# EAGLE design 120_01_ISC_BASE_BOARD (EAGLE 9.6.2)
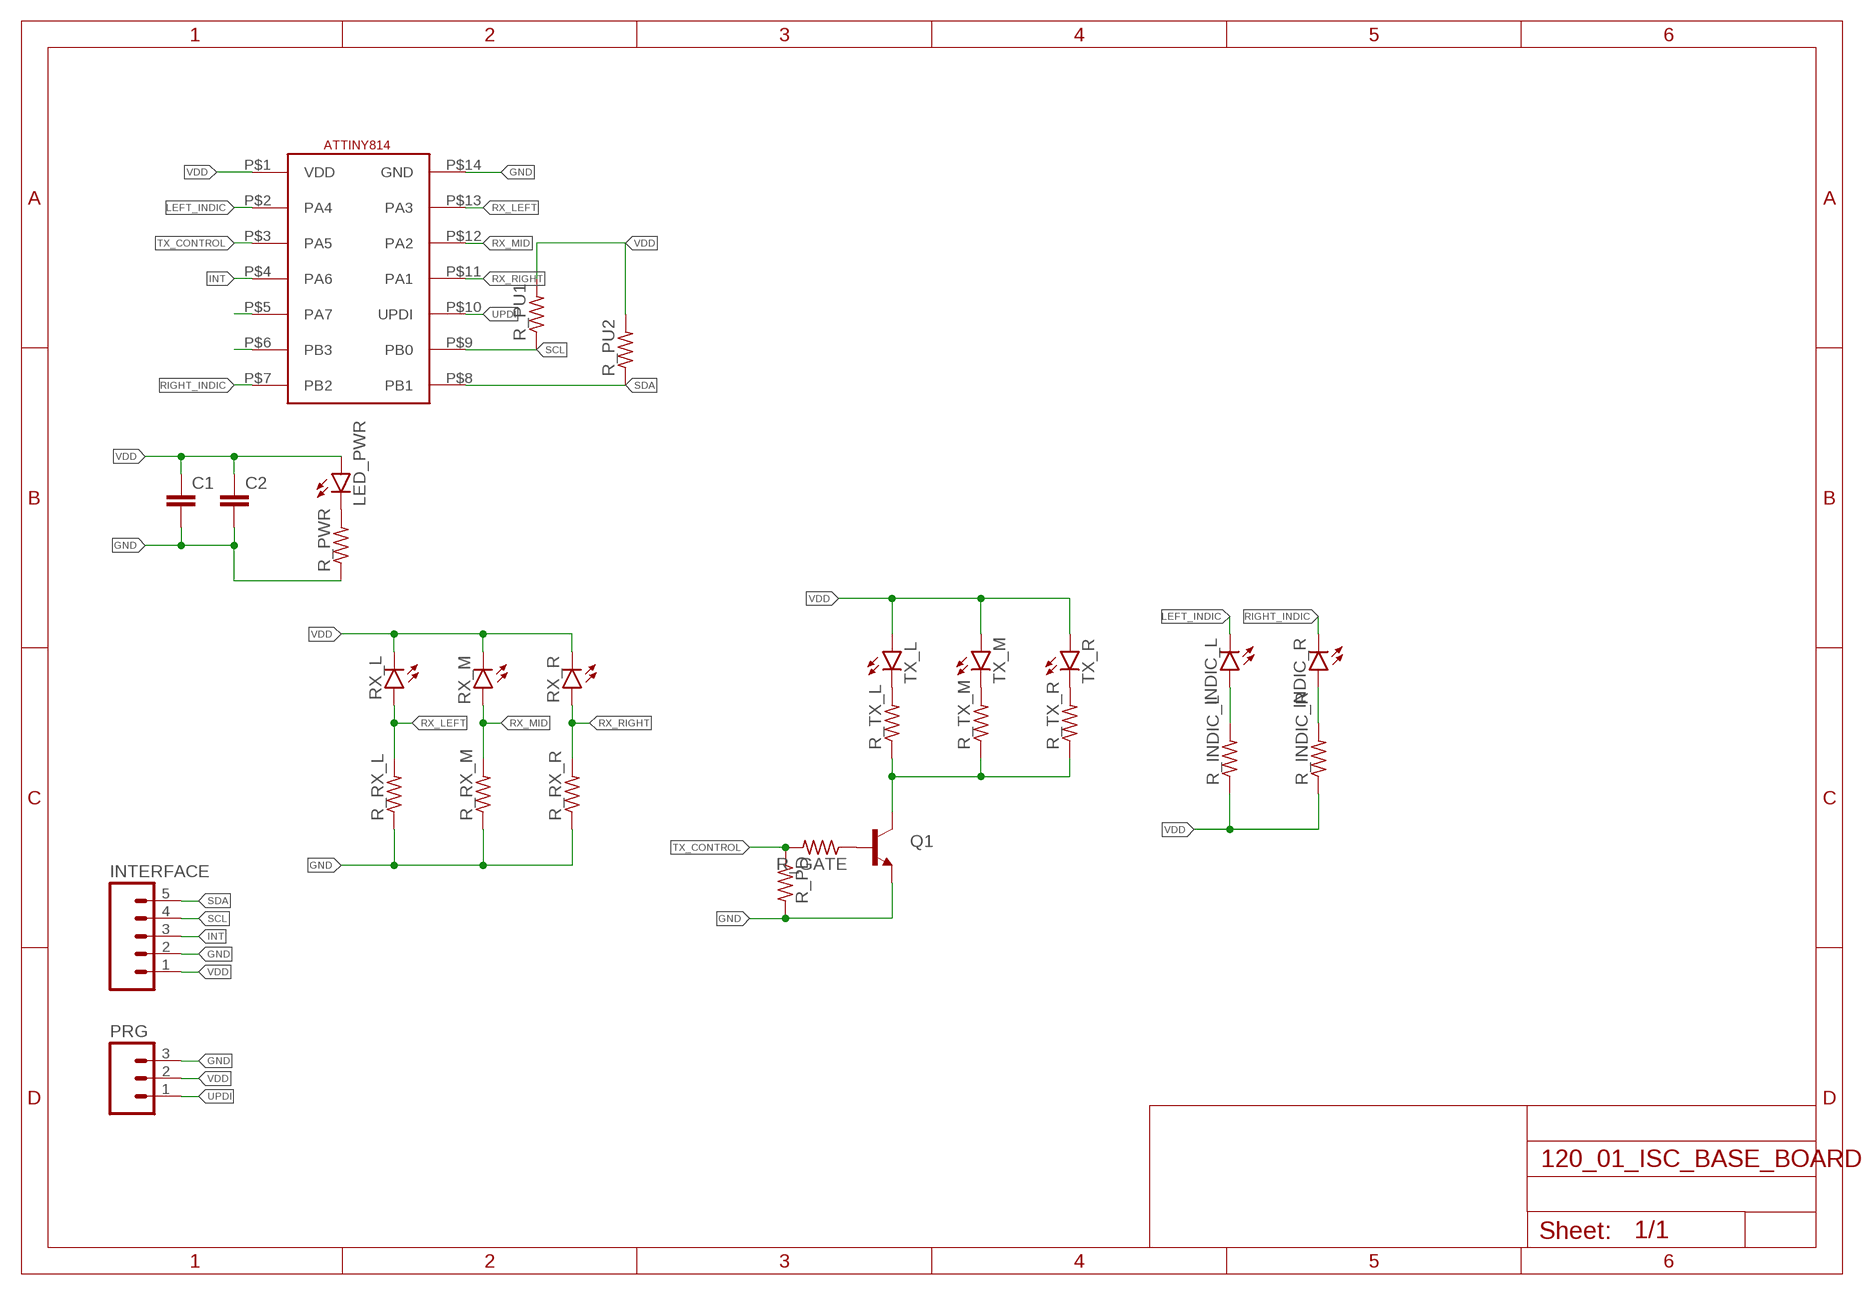
[diagram p0: schematic, sheet 1]

## Parts
C1  C-EUC0805  [C0805]
C2  C-EUC0805  [C0805]
INDIC_L  LED3MM  [LED3MM]
INDIC_R  LED3MM  [LED3MM]
INTERFACE  M05NO_SILK  [1X05_NO_SILK]
LED_PWR  LEDCHIP-LED0805  [CHIP-LED0805]
PRG  M03PTH  [1X03]
Q1  TRANSISTOR_NPNBC547  [TO-92-AMMO]
R_GATE  R-US_R0805  [R0805]
R_INDIC_L  R-US_R0805  [R0805]
R_INDIC_R  R-US_R0805  [R0805]
R_PD  R-US_R0805  [R0805]
R_PU1  R-US_R0805  [R0805]
R_PU2  R-US_R0805  [R0805]
R_PWR  R-US_R0805  [R0805]
R_RX_L  R-US_R0805  [R0805]
R_RX_M  R-US_R0805  [R0805]
R_RX_R  R-US_R0805  [R0805]
R_TX_L  R-US_R0805  [R0805]
R_TX_M  R-US_R0805  [R0805]
R_TX_R  R-US_R0805  [R0805]
RX_L  LED3MM  [LED3MM]
RX_M  LED3MM  [LED3MM]
RX_R  LED3MM  [LED3MM]
TX_L  LED5MM  [LED5MM]
TX_M  LED5MM  [LED5MM]
TX_R  LED5MM  [LED5MM]
U$1  ATTINY814  [ATTINY814]

## Nets
GND: C1.2 C2.2 INTERFACE.2 PRG.3 Q1.3(E) R_PD.2 R_PWR.1 R_RX_L.1 R_RX_M.1 R_RX_R.1 U$1.P$14(GND)
INT: INTERFACE.3 U$1.P$4(PA6)
LEFT_INDIC: INDIC_L.K(C) U$1.P$2(PA4)
N$1: LED_PWR.C R_PWR.2
N$2: INDIC_L.A R_INDIC_L.2
N$3: INDIC_R.A R_INDIC_R.2
N$5: R_TX_L.2 TX_L.K(C)
N$6: R_TX_M.2 TX_M.K(C)
N$7: R_TX_R.2 TX_R.K(C)
N$9: Q1.1(C) R_TX_L.1 R_TX_M.1 R_TX_R.1
N$10: Q1.2(B) R_GATE.1
N$12: U$1.P$6(PB3)
N$14: U$1.P$5(PA7)
RIGHT_INDIC: INDIC_R.K(C) U$1.P$7(PB2)
RX_LEFT: R_RX_L.2 RX_L.A U$1.P$13(PA3)
RX_MID: R_RX_M.2 RX_M.A U$1.P$12(PA2)
RX_RIGHT: R_RX_R.2 RX_R.A U$1.P$11(PA1)
SCL: INTERFACE.4 R_PU1.1 U$1.P$9(PB0)
SDA: INTERFACE.5 R_PU2.1 U$1.P$8(PB1)
TX_CONTROL: R_GATE.2 R_PD.1 U$1.P$3(PA5)
UPDI: PRG.1 U$1.P$10(UPDI)
VDD: C1.1 C2.1 INTERFACE.1 LED_PWR.A PRG.2 R_INDIC_L.1 R_INDIC_R.1 R_PU1.2 R_PU2.2 RX_L.K(C) RX_M.K(C) RX_R.K(C) TX_L.A TX_M.A TX_R.A U$1.P$1(VDD)

## Library data of the parts
C1 C2 = rcl:C-EU: CAPACITOR, European symbol; SPICEPREFIX: C
INDIC_L INDIC_R LED_PWR RX_L RX_M RX_R TX_L TX_M TX_R = led:LED: LED OSRAM: - CHIPLED LG R971, LG N971, LY N971, LG Q971, LY Q971, LO R971, LY R971 LH N974, LH R974 LS Q976, LO Q976, LY Q976 LO Q996 - Hyper CHIPLED LW Q18S LB Q993, LB Q99A, LB R99A - SideLED LS A670, LO A670, LY A670, LG A670, LP A670 LB A673, LV A673, LT A673, LW A673 LH A674 LY A675 LS A676, LA A676, LO A676, LY A676, LW A676 LS A679, LY A679, LG A679 - Hyper Micro SIDELED® LS Y876, LA Y876, LO Y876, LY Y876 LT Y87S - SmartLED LW L88C, LW L88S LB L89C, LB L89S, LG L890 LS L89K, LO L89K, LY L89K LS L896, LA L896, LO L896, LY L896 - TOPLED LS T670, LO T670, LY T670, LG T670, LP T670 LSG T670, LSP T670, LSY T670, LOP T670, LYG T670 LG T671, LOG T671, LSG T671 LB T673, LV T673, LT T673, LW T673 LH T674 LS T676, LA T676, LO T676, LY T676, LB T676, LH T676, LSB T676, LW T676 LB T67C, LV T67C, LT T67C, LS T67K, LO T67K, LY T67K, LW E67C LS E67B, LA E67B, LO E67B, LY E67B, LB E67C, LV E67C, LT E67C LW T67C LS T679, LY T679, LG T679 LS T770, LO T770, LY T770, LG T770, LP T770 LB T773, LV T773, LT T773, LW T773 LH T774 LS E675, LA E675, LY E675, LS T675 LS T776, LA T776, LO T776, LY T776, LB T776 LHGB T686 LT T68C, LB T68C - Hyper Mini TOPLED® LB M676 - Mini TOPLED Santana® LG M470 LS M47K, LO M47K, LY M47K Source: http://www.osram.convergy.de LUXEON: - LUMILED® LXK2-PW12-R00, LXK2-PW12-S00, LXK2-PW14-U00, LXK2-PW14-V00 LXK2-PM12-R00, LXK2-PM12-S00, LXK2-PM14-U00 LXK2-PE12-Q00, LXK2-PE12-R00, LXK2-PE12-S00, LXK2-PE14-T00, LXK2-PE14-U00 LXK2-PB12-K00, LXK2-PB12-L00, LXK2-PB12-M00, LXK2-PB14-N00, LXK2-PB14-P00, LXK2-PB14-Q00 LXK2-PR12-L00, LXK2-PR12-M00, LXK2-PR14-Q00, LXK2-PR14-R00 LXK2-PD12-Q00, LXK2-PD12-R00, LXK2-PD12-S00 LXK2-PH12-R00, LXK2-PH12-S00 LXK2-PL12-P00, LXK2-PL12-Q00, LXK2-PL12-R00 Source: www.luxeon.com KINGBRIGHT: KA-3528ASYC Source: www.kingbright.com
INTERFACE = SparkFun-Connectors:M05: Header 5 Standard 5-pin 0.1" header. Use with straight break away headers (SKU : PRT-00116), right angle break away headers (PRT-00553), swiss pins (PRT-00743), machine pins (PRT-00117), and female headers (PRT-00115). Molex polarized connector foot print use with SKU : PRT-08230 with associated crimp pins and housings.
PRG = SparkFun-Connectors:M03: Header 3 Standard 3-pin 0.1" header. Use with straight break away headers (SKU : PRT-00116), right angle break away headers (PRT-00553), swiss pins (PRT-00743), machine pins (PRT-00117), and female headers (PRT-00115). Molex polarized connector foot print use with SKU : PRT-08232 with associated crimp pins and housings.
Q1 = SparkFun-DiscreteSemi:TRANSISTOR_NPN: Generic NPN BJT MMBT2222A - TRANS-08049 (SOT-23, 1A 40V) MPSA42 - TRANS-09116 (SOT-23, 500mA 300V) MMBT5088LT1G - TRANS-11160 (SOT-23, 50 mA 30V) BC547 - COM-08928 <http://www.sparkfun.com/products/8928> (TO-92 45V 100mA) (1.Collector 2.Base 3.Emitter) 2N3904 - COM-00521 <http://www.sparkfun.com/products/521> (TO-92 40V 200mA) (1.Emitter 2.Base 3.Collector) P2N2222A - COM-12852 <http://www.sparkfun.com/products/12852> (TO-92 40V 600mA) (1.Collector 2.Base 3.Emitter)
R_GATE R_INDIC_L R_INDIC_R R_PD R_PU1 R_PU2 R_PWR R_RX_L R_RX_M R_RX_R R_TX_L R_TX_M R_TX_R = rcl:R-US_: RESISTOR, American symbol; SPICEPREFIX: R
U$1 = Stephen:ATTINY814

## Board
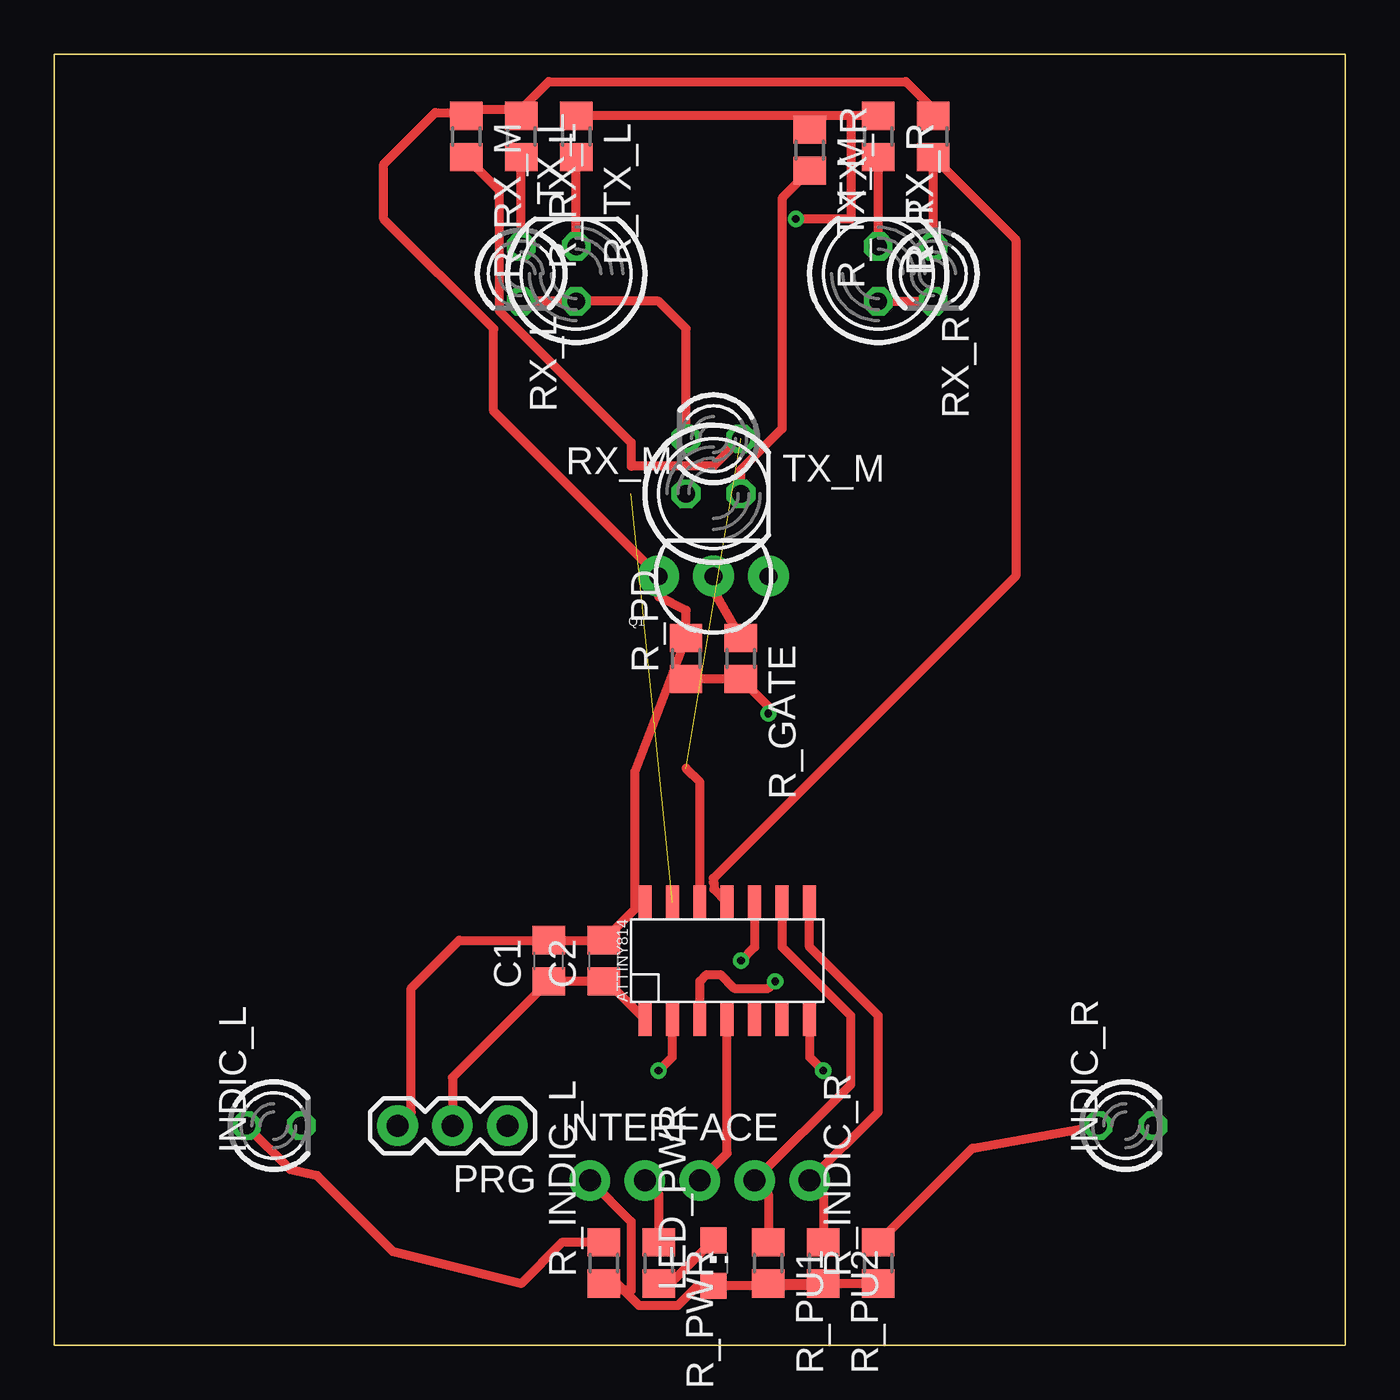
[diagram p1: board, top side]
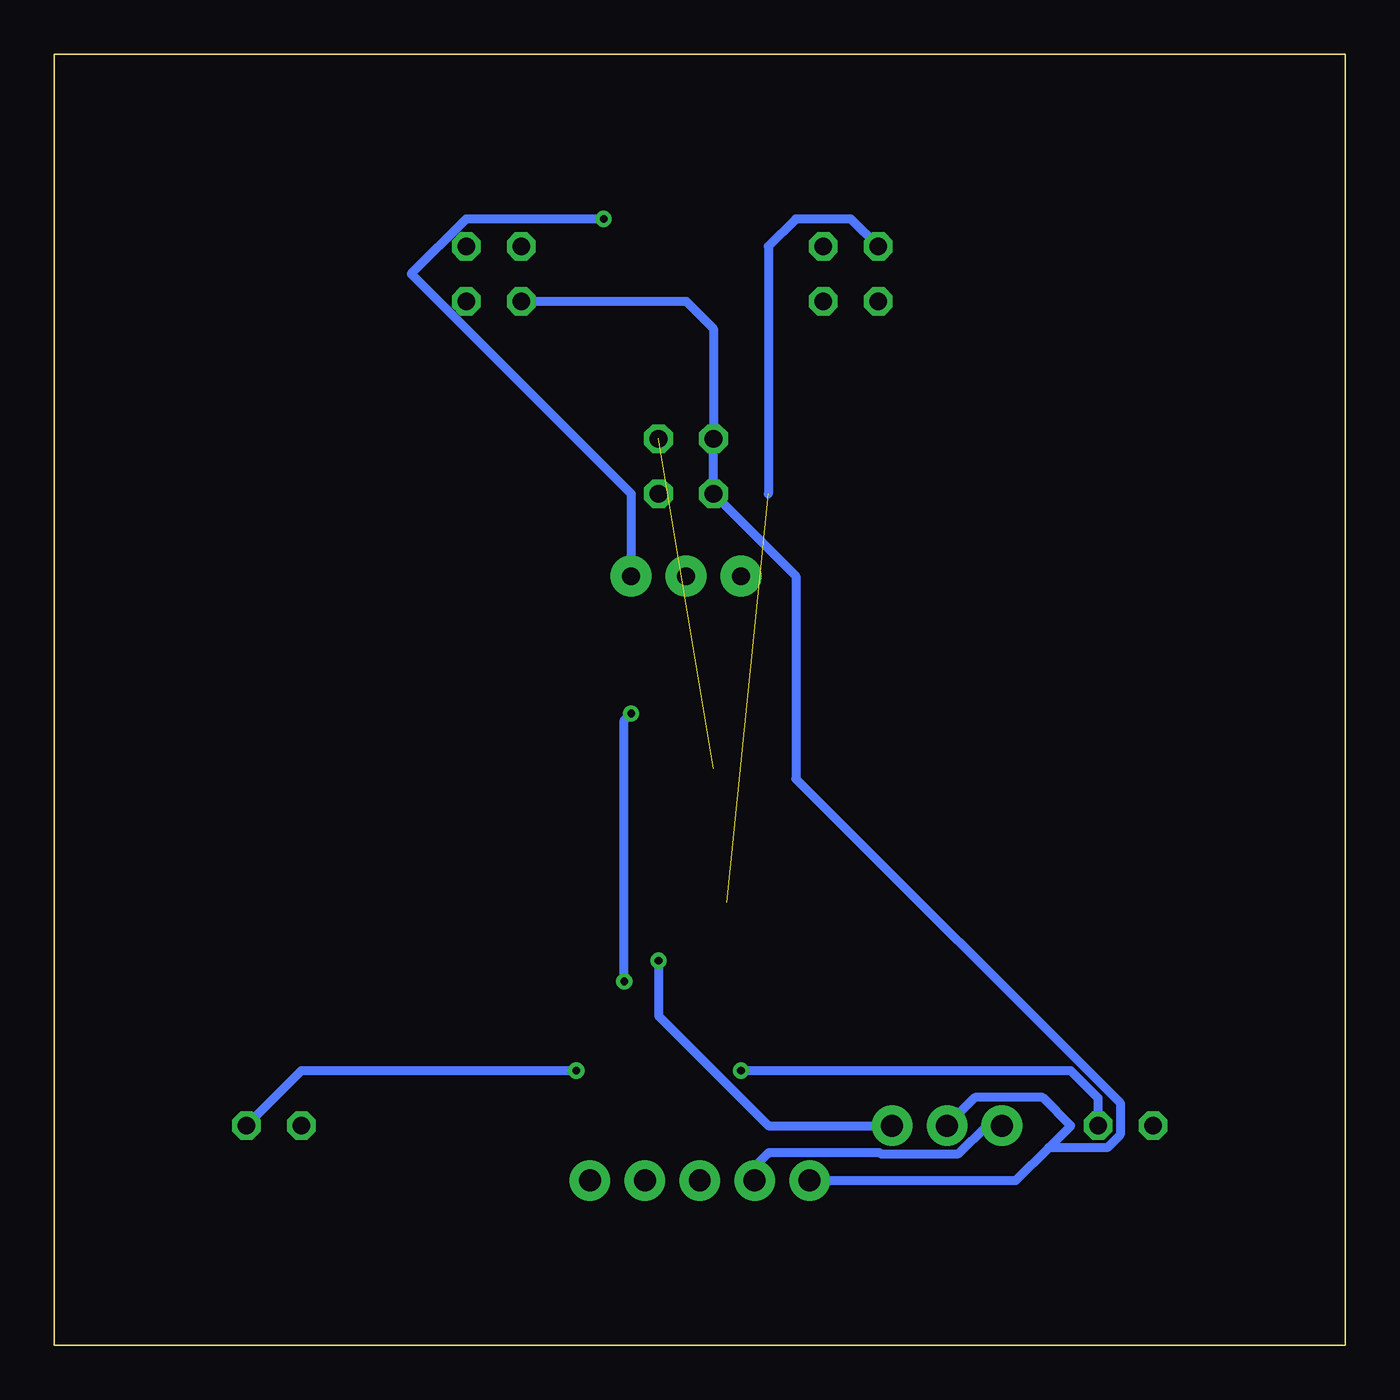
[diagram p2: board, bottom side, seen from below]

Size 59.69 x 59.69 mm. Coordinates in mm from the lower left corner, seen from the top.
Outline: 0,0 59.69,0 59.69,59.69 0,59.69 0,0
Copper layers (1*16): Top 0.035mm / dielectric 1.5mm / Bottom 0.035mm
Design rules "default": minimum track width 6mil, minimum drill 0.35mm, track to track 6mil, track to pad 6mil, pad to pad 6mil, via to via 6mil, smd to smd 6mil, copper to edge 40mil, drill to drill 6mil, minimum pad ring 10mil, minimum via ring 8mil, stop-mask expansion 4mil, vias tented up to drill 0mil, thermal gap 10mil

### Footprints (pad centres in the part's own frame; a part is rotated, then mirrored left to right if it is on the bottom)
C0805 = smd 1.3 x 1.5: 1 -0.95,0; 2 0.95,0
LED3MM = drill 0.813 octagon: A -1.27,0; K 1.27,0
1X05_NO_SILK = drill 1.016 pad 1.88: 1 0,0; 2 2.54,0; 3 5.08,0; 4 7.62,0; 5 10.16,0
CHIP-LED0805 = smd 1.2 x 1.2: A 0,-1.05; C 0,1.05
1X03 = drill 1.016 pad 1.88: 1 0,0; 2 2.54,0; 3 5.08,0
TO-92-AMMO = drill 0.813 pad 1.88: 1 -2.54,0; 2 0,0; 3 2.54,0
R0805 = smd 1.3 x 1.5: 1 -0.95,0; 2 0.95,0
LED5MM = drill 0.813 octagon: A -1.27,0; K 1.27,0
ATTINY814 = smd 1.55 x 0.6: P$1 -2.7,3.175; P$2 -2.7,1.905; P$3 -2.7,0.635; P$4 -2.7,-0.635; P$5 -2.7,-1.905; P$6 -2.7,-3.175; P$7 -2.7,-4.445; P$8 2.7,-4.445; P$9 2.7,-3.175; P$10 2.7,-1.905; P$11 2.7,-0.635; P$12 2.7,0.635; P$13 2.7,1.905; P$14 2.7,3.175

### Placement (x,y rotation side)
C1  22.86,17.78 90 top
C2  25.4,17.78 90 top
INDIC_L  10.16,10.16 0 top
INDIC_R  49.53,10.16 0 top
INTERFACE  24.77,7.62 0 top
LED_PWR  30.48,3.81 0 top
PRG  20.95,10.16 180 top
Q1  30.48,35.56 180 top
R_GATE  31.75,31.75 270 top
R_INDIC_L  25.4,3.81 90 top
R_INDIC_R  38.1,3.81 90 top
R_PD  29.21,31.75 90 top
R_PU1  33.02,3.81 270 top
R_PU2  35.56,3.81 270 top
R_PWR  27.94,3.81 270 top
R_RX_L  21.59,55.88 270 top
R_RX_M  19.05,55.88 270 top
R_RX_R  40.64,55.88 270 top
R_TX_L  24.13,55.88 270 top
R_TX_M  34.92,55.24 270 top
R_TX_R  38.1,55.88 270 top
RX_L  21.59,49.53 270 top
RX_M  30.48,41.91 180 top
RX_R  40.64,49.53 270 top
TX_L  24.13,49.53 90 top
TX_M  30.48,39.37 0 top
TX_R  38.1,49.53 90 top
U$1  30.48,17.78 90 top

### Tracks (layer width: path | path; a pad name or v marks a point on that pad's centre or on a via)
GND
  Top 0.406: 26.83,20.16 C2.2 C1.2 18.73,18.73 16.51,16.51 16.51,10.79 PRG.3 | 26.83,20.16 27.15,20.48 U$1.P$14 | 26.83,20.16 26.83,26.51 R_PD.2 29.21,33.97 27.94,34.61 Q1.3 20.32,43.18 20.32,46.99 15.24,52.07 15.24,54.61 17.62,56.99 19.21,56.99 | R_RX_L.1 21.59,57.15 | 21.59,57.15 22.86,58.42 39.37,58.42 40.64,57.15 R_RX_R.1 | R_RX_M.1 19.21,56.99 | 19.21,56.99 19.37,57.15 21.59,57.15 | INTERFACE.2 27.94,6.99 R_PWR.1
  Bottom 0.406: INTERFACE.2 27.3,8.26 26.64,8.91 21.54,8.91 21.49,8.87 17.88,8.87 16.58,10.16 PRG.3
INT
  Top 0.406: INTERFACE.3 31.11,8.89 U$1.P$4
LEFT_INDIC  (via drill 0.35)
  Top 0.406: v27.94,12.7 28.57,13.34 U$1.P$2
  Bottom 0.406: INDIC_L.K 11.43,11.43 12.7,12.7 22.86,12.7 23.34,12.7 v27.94,12.7
N$1
  Top 0.406: R_PWR.2 28.48,2.86 LED_PWR.C
N$2
  Top 0.406: INDIC_L.A 10.92,8.13 12.16,7.84 15.67,4.33 21.58,2.86 23.48,4.76 R_INDIC_L.2
N$3
  Top 0.406: R_INDIC_R.2 42.45,9.11 INDIC_R.A
N$5
  Top 0.406: TX_L.K R_TX_L.2
N$6
  Top 0.406: TX_M.K 31.75,40.47 33.66,42.38 33.66,53.02 R_TX_M.2
N$7
  Top 0.406: TX_R.K R_TX_R.2
N$9  (via drill 0.35)
  Top 0.406: R_TX_R.1 36.83,56.83 | 36.83,56.83 35.56,56.83 | 35.56,56.83 R_TX_L.1 | R_TX_M.1 35.56,56.83 | 36.83,56.83 36.83,52.07 v34.29,52.07
  Bottom 0.406: v34.29,52.07 40.64,52.07 43.18,49.53 33.02,39.37 Q1.1
N$10
  Top 0.406: R_GATE.1 30.48,34.92 Q1.2
RIGHT_INDIC  (via drill 0.35)
  Top 0.406: U$1.P$7 34.92,13.34 v35.56,12.7
  Bottom 0.406: v35.56,12.7 48.26,12.7 INDIC_R.K
RX_LEFT  (1 unrouted)
  Top 0.406: RX_L.A R_RX_L.2
  Bottom 0.406: RX_L.A 22.86,52.07 25.4,52.07 26.67,50.8 26.67,39.37
RX_MID  (1 unrouted)
  Top 0.406: U$1.P$12 29.84,26.04 29.21,26.67 | RX_M.A 30.48,40.64 26.67,40.64 26.67,41.74 20.57,47.84 20.57,53.41 R_RX_M.2
RX_RIGHT
  Top 0.406: 40.64,51.12 RX_R.A R_RX_R.2 44.45,51.12 44.45,35.56 30.48,21.59 30.48,21.42 30.5,21.4 30.5,21.09 U$1.P$11
SCL
  Top 0.406: R_PU1.1 33.02,6.99 INTERFACE.4 36.83,12.06 36.83,15.24 33.66,18.41 U$1.P$9
SDA
  Top 0.406: R_PU2.1 35.56,6.99 INTERFACE.5 38.1,10.79 38.1,15.24 34.92,18.41 U$1.P$8
TX_CONTROL  (via drill 0.35)
  Top 0.406: R_PD.1 R_GATE.2 33.02,29.53 v33.02,29.21 | U$1.P$3 29.84,16.83 30.16,17.14 30.8,17.14 31.43,16.51 33.02,16.51 v33.34,16.83
  Bottom 0.406: v33.34,16.83 33.34,28.89 v33.02,29.21
UPDI  (via drill 0.35)
  Top 0.406: U$1.P$10 32.38,18.41 v31.75,17.78
  Bottom 0.406: v31.75,17.78 31.75,15.24 26.67,10.16 PRG.1
VDD
  Top 0.406: RX_L.K TX_L.A 27.94,48.26 29.21,46.99 RX_M.K | TX_R.A RX_R.K | U$1.P$1 25.55,16.83 C2.1 C1.1 18.41,12.38 PRG.2 | R_INDIC_R.1 R_PU1.2 R_PU2.2 35.46,2.76 LED_PWR.A 29.74,2.76 28.84,1.85 27.04,1.85 26.04,2.86 R_INDIC_L.1 25.72,2.54 26.67,2.54 26.67,5.71 INTERFACE.1
  Bottom 0.406: TX_R.A 30.48,48.26 29.21,46.99 RX_M.K TX_M.A 25.4,35.56 25.4,26.19 10.41,11.2 10.41,9.74 11.01,9.14 13.72,9.14 | INTERFACE.1 15.24,7.62 13.72,9.14 | 13.72,9.14 12.7,10.16 13.99,11.46 17.12,11.46 PRG.2